# Altium project LCDv3.PrjPcb
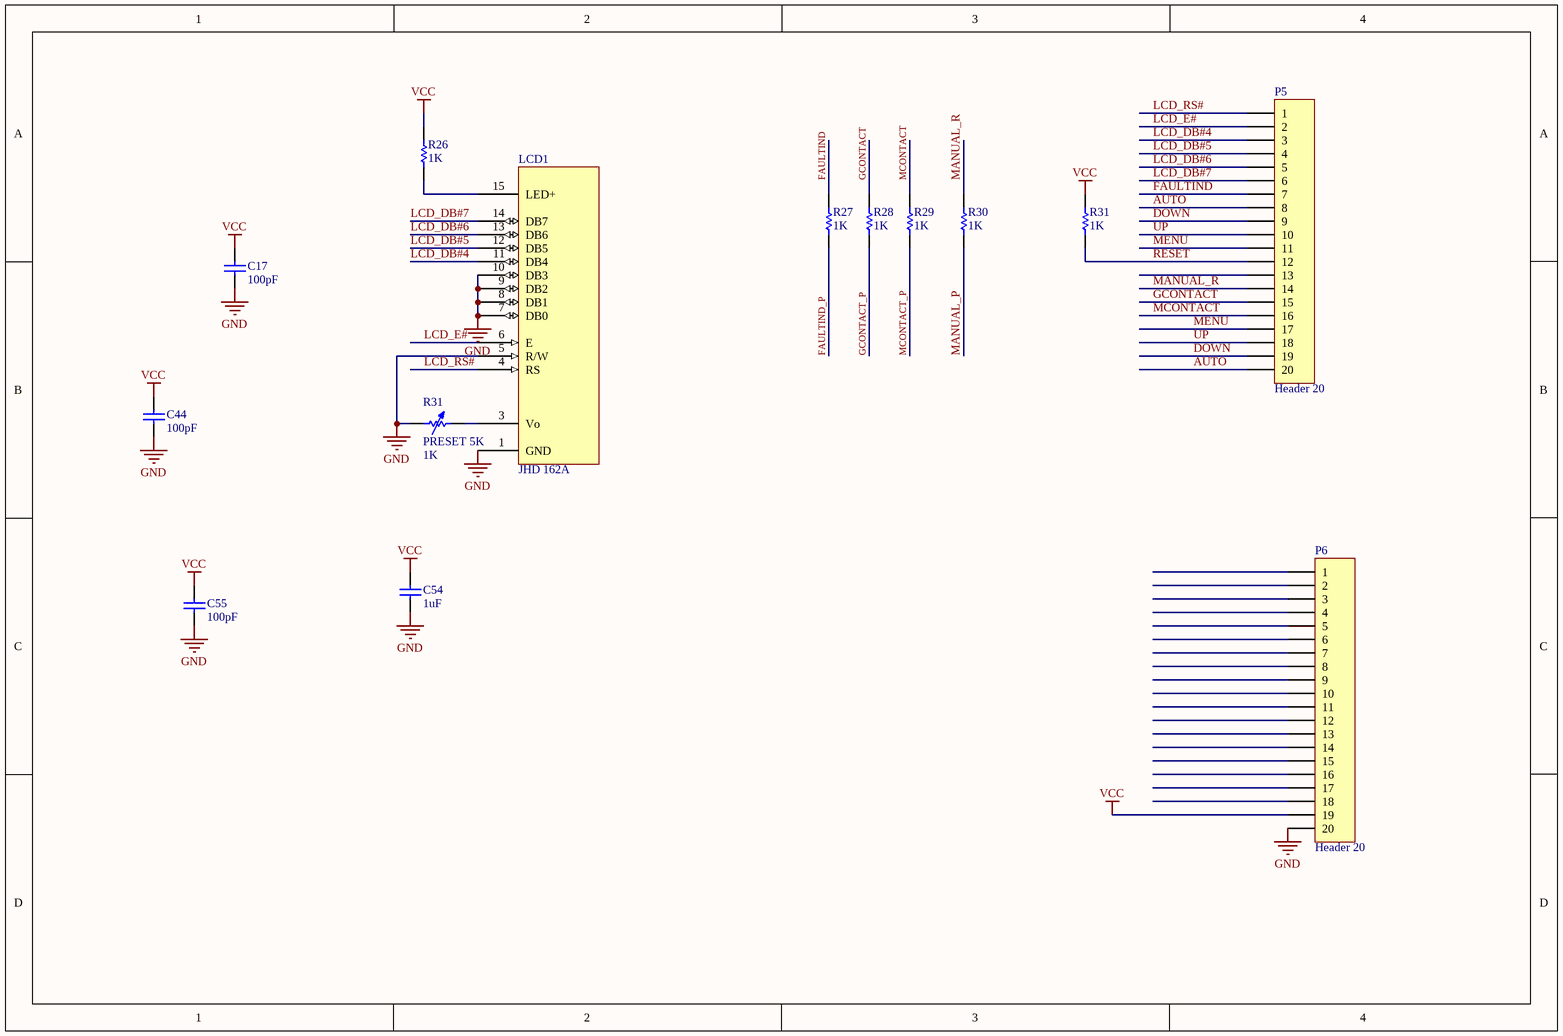
[diagram p0: KEYBOARD.SchDoc]
2 sheets, 17 parts. Net scope: global (net labels, ports and power ports of the same name join across sheets).
Board file: A5.PcbDoc
Sheets:
  KEYBOARD.SchDoc
  SWITCHES.SchDoc

## Sheet KEYBOARD.SchDoc
size A4; DrawnBy: SURAJ; SheetNumber: 4

### Parts
(Parts that share a designator on the sheet are numbered #1, #2 ... from top to bottom, then left to right.)
C17  value 100pF  [C1206]  (hidden comment: .1uF 1206)
C44  value 100pF  [C1206]  (hidden comment: .1uF 1206)
C54  value 1uF  [C1206]  (hidden comment: 1uF 1206)
C55  value 100pF  [C1206]  (hidden comment: .1uF 1206)
LCD1  JHD 162A  [162A]
P5  Header 20  [HDR1X20_BURGE_M]
P6  Header 20  [HDR1X20_BURGE_M]
R26  value 1K  [R1206]  (hidden comment: 470E 1206)
R27  value 1K  [R1206]  (hidden comment: 470E 1206)
R28  value 1K  [R1206]  (hidden comment: 470E 1206)
R29  value 1K  [R1206]  (hidden comment: 470E 1206)
R30  value 1K  [R1206]  (hidden comment: 470E 1206)
R31#1  value 1K  [R1206]  (hidden comment: 4.7K 1206)
R31#2  PRESET 5K  value 1K  [POT]

### Nets
GND: C17.1 C44.1 C54.1 C55.1 LCD1.1(GND) LCD1.5(R/W) LCD1.7(DB0) LCD1.8(DB1) LCD1.9(DB2) LCD1.10(DB3) LCD1.16(LED-) P6.20 R31#2.1
VCC: C17.2 C44.2 C54.2 C55.2 LCD1.2(VDD) P6.19 R26.2 R31#1.1
AUTO: P5.8 P5.20
DOWN: P5.9 P5.19
FAULTIND: P5.7 R27.1
FAULTIND_P: R27.2
GCONTACT: P5.15 R28.1
GCONTACT_P: R28.2
LCD_DB#4: LCD1.11(DB4) P5.3
LCD_DB#5: LCD1.12(DB5) P5.4
LCD_DB#6: LCD1.13(DB6) P5.5
LCD_DB#7: LCD1.14(DB7) P5.6
LCD_E#: LCD1.6(E) P5.2
LCD_RS#: LCD1.4(RS) P5.1
MANUAL_P: R30.2
MANUAL_R: P5.14 R30.1
MCONTACT: P5.16 R29.1
MCONTACT_P: R29.2
MENU: P5.11 P5.17
RESET: P5.12 R31#1.2
UP: P5.10 P5.18
NetLCD1_3: LCD1.3(Vo) R31#2.2
NetLCD1_15: LCD1.15(LED+) R26.1

Not connected (* = marked no-connect by the designer): P5 13; P6 1 2 3 4 5 6 7 8 9 10 11 12 13 14 15 16 17 18

### Library data of the parts
C17 C44 C54 C55 = Cap: Capacitor; Published: 8-Jun-2000; LatestRevisionDate: 17-Jul-2002; LatestRevisionNote: Re-released for DXP Platform.; PackageReference: RAD-0.3; Publisher: Altium Limited; PackageDescription: Radial Cap, Thru-Hole; 2 Leads; 0.3 in Pin Spacing
LCD1 = 162A: 16 char * 2 line LCD character display with b/light
P5 P6 = Header 20: Header, 20-Pin; LatestRevisionDate: 17-Jul-2002; LatestRevisionNote: Re-released for DXP Platform.; Publisher: Altium Limited
R26-R30 R31#1 = Res1: Resistor; Published: 8-Jun-2000; LatestRevisionDate: 17-Jul-2002; LatestRevisionNote: Re-released for DXP Platform.; Publisher: Altium Limited; PackageDescription: Axial Device, Thru-Hole; 2 Leads; 0.3 in Pin Spacing
  R26: PackageReference: AXIAL-0.4
  R27-R30 R31#1: PackageReference: AXIAL-0.3
R31#2 = Res Adj1: Variable Resistor; Set Position: 0.5; Published: 8-Jun-2000; LatestRevisionDate: 17-Jul-2002; LatestRevisionNote: Re-released for DXP Platform.; PackageReference: AXIAL-0.7; Publisher: Altium Limited; PackageDescription: Axial Device, Thru-Hole; 2 Leads; 0.7 in Pin Spacing

## Sheet SWITCHES.SchDoc
size A
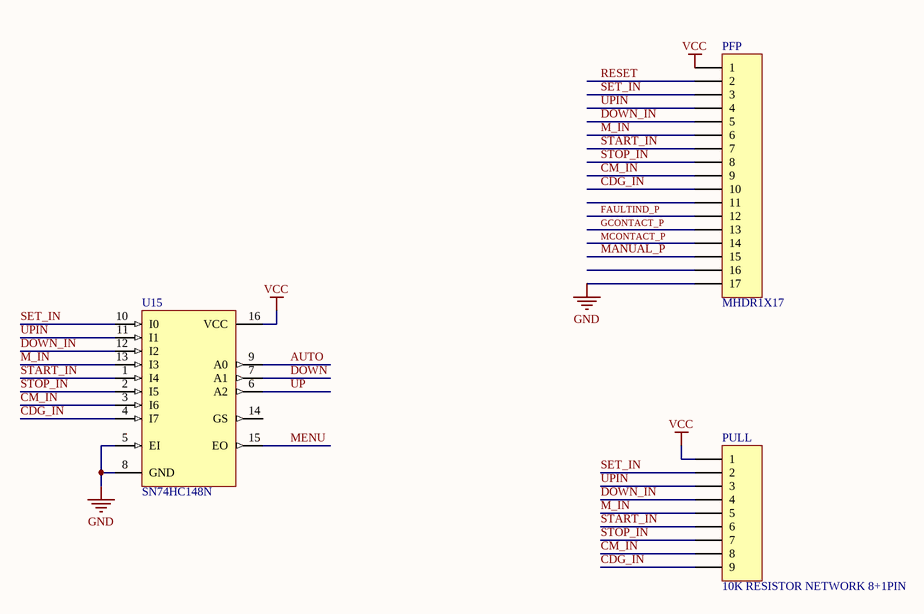
[diagram p1: SWITCHES.SchDoc]

### Parts
PFP  MHDR1X17  [HDR1X17_BURGE_F]
PULL  10K RESISTOR NETWORK 8+1PIN  [RESPACK8+1]
U15  SN74HC148N  [N016D]

### Nets
GND: PFP.17 U15.5(EI) U15.8(GND)
VCC: PFP.1 PULL.1 U15.16(VCC)
AUTO: U15.9(A0)
CDG_IN: PFP.10 PULL.9 U15.4(I7)
CM_IN: PFP.9 PULL.8 U15.3(I6)
DOWN: U15.7(A1)
DOWN_IN: PFP.5 PULL.4 U15.12(I2)
FAULTIND_P: PFP.12
GCONTACT_P: PFP.13
M_IN: PFP.6 PULL.5 U15.13(I3)
MANUAL_P: PFP.15
MCONTACT_P: PFP.14
MENU: U15.15(EO)
RESET: PFP.2
SET_IN: PFP.3 PULL.2 U15.10(I0)
START_IN: PFP.7 PULL.6 U15.1(I4)
STOP_IN: PFP.8 PULL.7 U15.2(I5)
UP: U15.6(A2)
UPIN: PFP.4 PULL.3 U15.11(I1)

Not connected (* = marked no-connect by the designer): PFP 11 16; U15 14(GS)

### Library data of the parts
PFP = MHDR1X17: Header, 17-Pin; LatestRevisionDate: 17-Jul-2002; LatestRevisionNote: Re-released for DXP Platform.; Publisher: Altium Limited
PULL = Header 9: Header, 9-Pin; LatestRevisionDate: 17-Jul-2002; LatestRevisionNote: Re-released for DXP Platform.; Publisher: Altium Limited
U15 = SN74HC148N: 8-Line to 3-Line Priority Encoder; Published: 8-Jun-2000; LatestRevisionDate: 04-Mar-2005; LatestRevisionNote: Stylized 3D Model Added.; DatasheetVersion: Jun-1989; PackageVersion: Oct-1995; PackageReference: N016D; Publisher: Altium Limited; PackageDescription: DIP; 16 Leads; Row Spacing 7.62 mm; Pitch 2.54 mm; Code_JEDEC: MS-001-BB; ComponentLink1Description: Manufacturer Link; ComponentLink1URL: http://www.ti.com/; ComponentLink2Description: Datasheet; ComponentLink2URL: http://www-s.ti.com/sc/ds/sn74hc148.pdf

## Nets that join several sheets
GND: KEYBOARD (13 pins), SWITCHES (PFP.17 U15.5 U15.8)
VCC: KEYBOARD (8 pins), SWITCHES (PFP.1 PULL.1 U15.16)
AUTO: KEYBOARD (P5.8 P5.20), SWITCHES (U15.9)
DOWN: KEYBOARD (P5.9 P5.19), SWITCHES (U15.7)
FAULTIND_P: KEYBOARD (R27.2), SWITCHES (PFP.12)
GCONTACT_P: KEYBOARD (R28.2), SWITCHES (PFP.13)
MANUAL_P: KEYBOARD (R30.2), SWITCHES (PFP.15)
MCONTACT_P: KEYBOARD (R29.2), SWITCHES (PFP.14)
MENU: KEYBOARD (P5.11 P5.17), SWITCHES (U15.15)
RESET: KEYBOARD (P5.12 R31#1.2), SWITCHES (PFP.2)
UP: KEYBOARD (P5.10 P5.18), SWITCHES (U15.6)